# Altium schematic sheet Sheet_1_2025-10-18.schdoc
size 289 x 164 mm
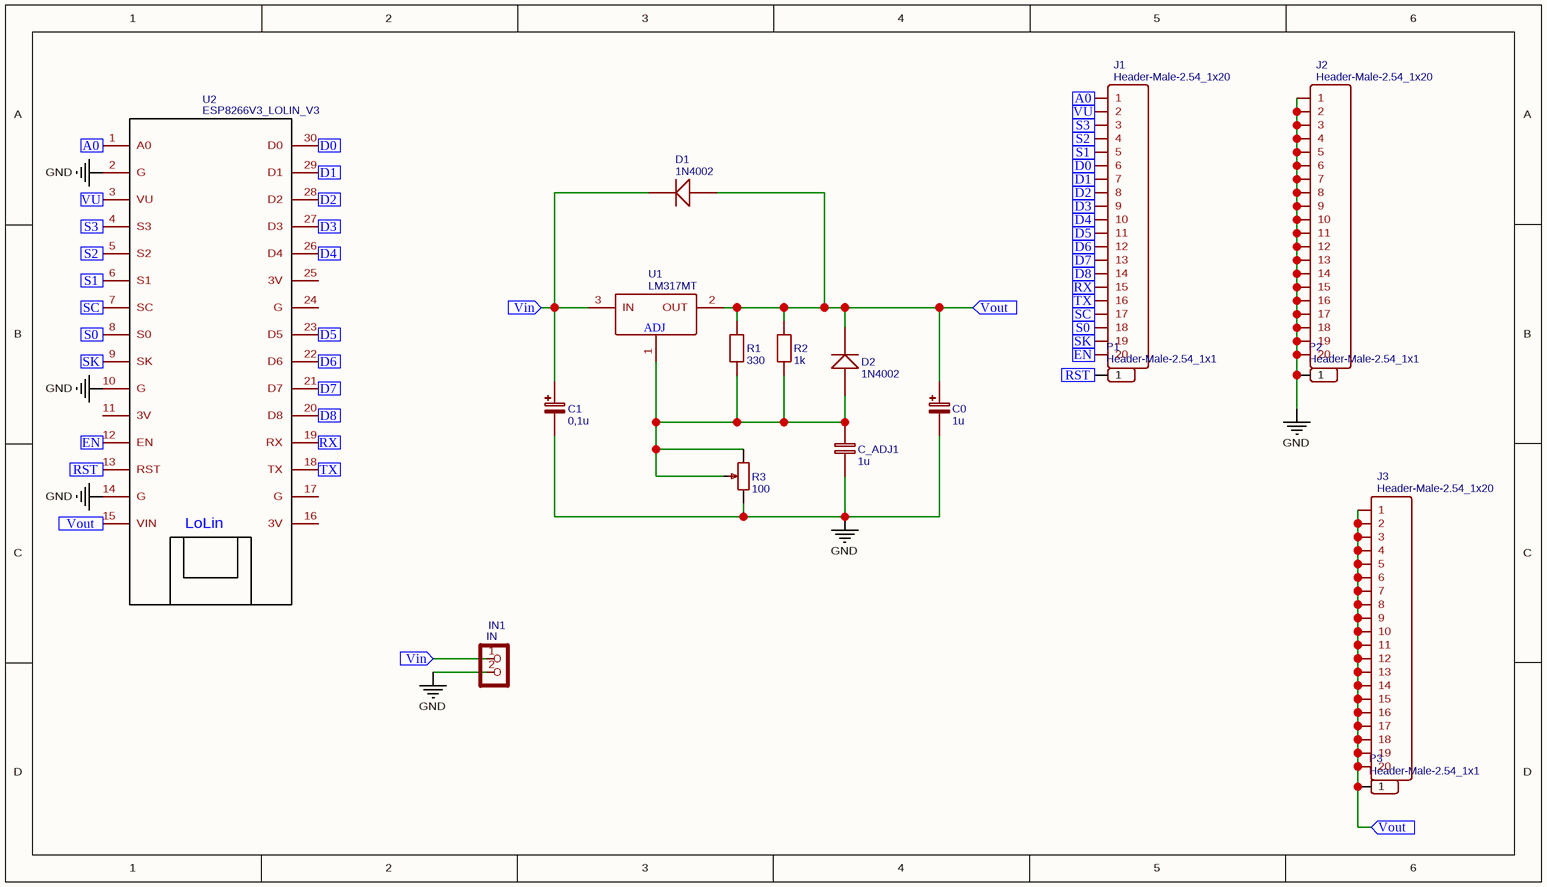
[diagram p0: Sheet_1_2025-10-18.schdoc]

## Parts
C0  1u  [CAP-D3.0XF1.5]
C1  0,1u  [CAP-D3.0XF1.5]
C_ADJ1  1u  [RAD-0.1]
D1  1N4002  [DO-41]
D2  1N4002  [DO-41]
IN1  IN  [TERMINAL_BLOCK_2P_5]
J1  Header-Male-2.54_1x20  [HDR-TH_20PIN-V-MALE-PITCH2.54]
J2  Header-Male-2.54_1x20  [HDR-TH_20PIN-V-MALE-PITCH2.54]
J3  Header-Male-2.54_1x20  [HDR-TH_20PIN-V-MALE-PITCH2.54]
P1  Header-Male-2.54_1x1  [HDR-1X1/2.54]
P2  Header-Male-2.54_1x1  [HDR-1X1/2.54]
P3  Header-Male-2.54_1x1  [HDR-1X1/2.54]
R1  330  [AXIAL-0.3]
R2  1k  [AXIAL-0.3]
R3  100  [RES-ADJ_3386P]
U1  LM317MT  [221A-06]
U2  ESP8266V3_LOLIN_V3  [ESP8266.LOLIN_V3]

## Ports
A0 (in), D0 (in), D1 (in), D2 (in), D3 (in), D4 (in), D5 (in), D6 (in), D7 (in), D8 (in), EN (in), RST (in), RX (in), S0 (in), S1 (in), S2 (in), S3 (in), SC (in), SK (in), TX (in), Vin (in), Vout (in), VU (in)

## Nets
GND: C0.2 C1.2 C_ADJ1.2 IN1.2 J2.1 J2.2 J2.3 J2.4 J2.5 J2.6 J2.7 J2.8 J2.9 J2.10 J2.11 J2.12 J2.13 J2.14 J2.15 J2.16 J2.17 J2.18 J2.19 J2.20 P2.1 R3.3 U2.2(G) U2.10(G) U2.14(G)
A0: J1.1 U2.1(A0) ; port A0
D0: J1.6 U2.30(D0) ; port D0
D1: J1.7 U2.29(D1) ; port D1
D2: J1.8 U2.28(D2) ; port D2
D3: J1.9 U2.27(D3) ; port D3
D4: J1.10 U2.26(D4) ; port D4
D5: J1.11 U2.23(D5) ; port D5
D6: J1.12 U2.22(D6) ; port D6
D7: J1.13 U2.21(D7) ; port D7
D8: J1.14 U2.20(D8) ; port D8
EN: J1.20 U2.12(EN) ; port EN
RST: P1.1 U2.13(RST) ; port RST
RX: J1.15 U2.19(RX) ; port RX
S0: J1.18 U2.8(S0) ; port S0
S1: J1.5 U2.6(S1) ; port S1
S2: J1.4 U2.5(S2) ; port S2
S3: J1.3 U2.4(S3) ; port S3
SC: J1.17 U2.7(SC) ; port SC
SK: J1.19 U2.9(SK) ; port SK
TX: J1.16 U2.18(TX) ; port TX
Vin: C1.1 D1.2(K) IN1.1 U1.3(IN) ; port Vin
Vout: C0.1 D1.1(A) D2.2(K) J3.1 J3.2 J3.3 J3.4 J3.5 J3.6 J3.7 J3.8 J3.9 J3.10 J3.11 J3.12 J3.13 J3.14 J3.15 J3.16 J3.17 J3.18 J3.19 J3.20 P3.1 R1.2 R2.2 U1.2(OUT) U2.15(VIN) ; port Vout
VU: J1.2 U2.3(VU) ; port VU
NetC_ADJ1_1: C_ADJ1.1 D2.1(A) R1.1 R2.1 R3.1 R3.2 U1.1(ADJ)

Not connected (* = marked no-connect by the designer): U2 11(3V) 16(3V) 17(G) 24(G) 25(3V)

## Notes on the sheet
- (in symbol ESP8266V3_LOLIN_V3) LoLin

## Library data of the parts
C0 = 1u: nameAlias: Value(F); Contributor: EasyEDA; spicePre: C; spiceSymbolName: Cap_Electrolytic(TH)_D3.0XF1.5_EU
C1 = 0,1u: nameAlias: Value(F); Contributor: EasyEDA; spicePre: C; spiceSymbolName: Cap_Electrolytic(TH)_D3.0XF1.5_EU
C_ADJ1 = 1u: nameAlias: Value(F); spicePre: C; spiceSymbolName: Cap_RAD-0.1_EU
D1 D2 = 1N4002: description: 1.0 Ampere General Purpose Rectifier; spicePre: D; spiceSymbolName: 1N4002
IN1 = IN: description: 2 poles wire to board terminal block; Contributor: DangerousPrototype; spicePre: J; spiceSymbolName: CON_TERMINAL_BLOCK_02-5MM
J1-J3 = Header-Male-2.54_1x20: Manufacturer: BOOMELE; Manufacturer Part: 2.54mm 1*20PHeader; Supplier: LCSC; image: //image.lceda.cn/szlcsc/C50981.jpg; Supplier Part: C50981; spicePre: J; spiceSymbolName: Header-Male-2.54_1x20
P1-P3 = Header-Male-2.54_1x1: Manufacturer: ReliaPro; Supplier: LCSC; Manufacturer Part: Header-Male-2.54_1x1; Supplier Part: C81276; spicePre: P; spiceSymbolName: Header-Male-2.54_1x1
R1 = 330: nameAlias: Value(Ω); spicePre: R; spiceSymbolName: Res_AXIAL-0.3(1/8W)_EU
R2 = 1k: nameAlias: Value(Ω); spicePre: R; spiceSymbolName: Res_AXIAL-0.3(1/8W)_EU
R3 = 100: Manufacturer: Bochen; Manufacturer Part: 3386P-1-101LF; nameAlias: Resistance (Ohms); Supplier: LCSC; Resistance(Ohms): 100; Supplier Part: C125022; spicePre: R; spiceSymbolName: 3386P-1-101LF
U1 = LM317MT: description: Three-Terminal Adjustable Output Positive Voltage Regulator; spicePre: U; spiceSymbolName: LM317MT
U2 = ESP8266V3_LOLIN_V3: nameAlias: Model; Contributor: amocachi; sourceId: OGtr1ZXUS; spicePre: X; timeStamp: 1458805415; spiceSymbolName: ESP8266V3_LOLIN_V3